# EAGLE schematic AC Breakout (EAGLE 5.11)
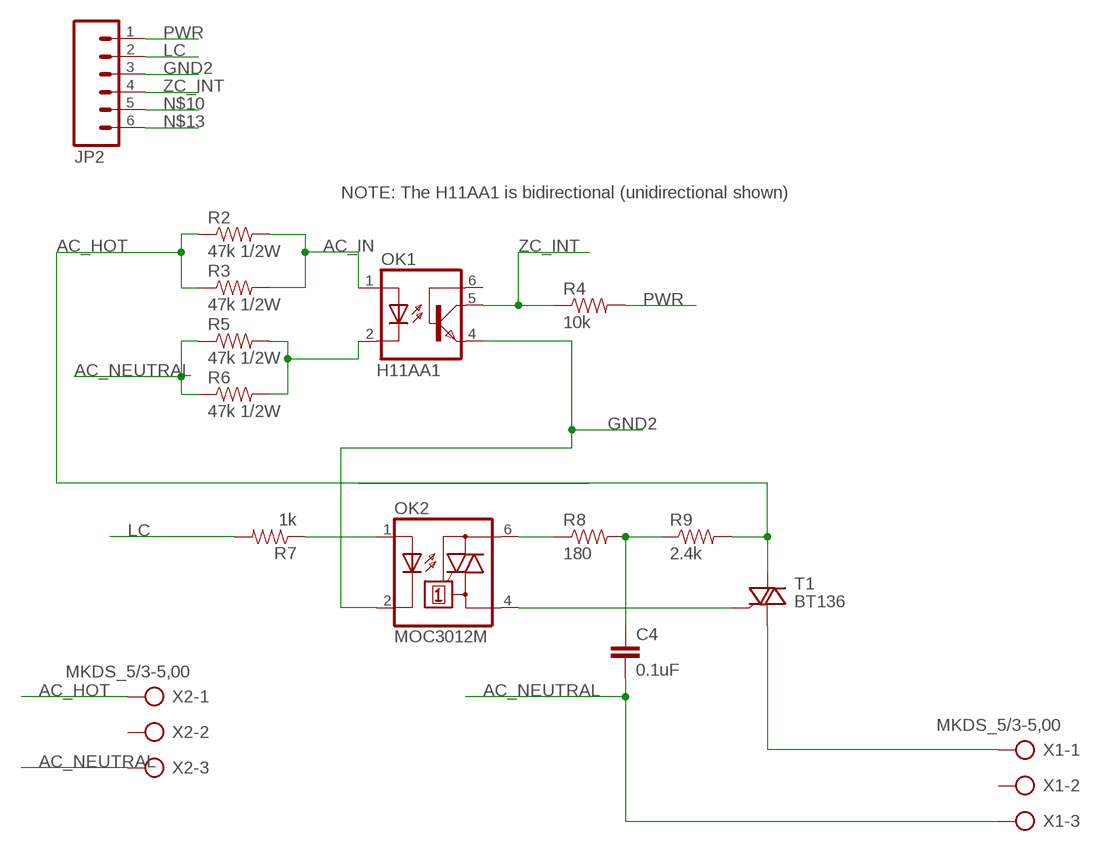
[diagram p0: schematic, sheet 1]

## Parts
C4  0.1uF  CAPPTH2  [CAP-PTH-SMALL2]
JP2  M06SIP  [1X06]
OK1  4N25M  [DIL06]
OK2  MOC3012M  [DIL06]
R2  47k 1/2W  RESISTORPTH-1/2W  [AXIAL-0.5]
R3  47k 1/2W  RESISTORPTH-1/2W  [AXIAL-0.5]
R4  10k  RESISTORPTH-1/4W  [AXIAL-0.4]
R5  47k 1/2W  RESISTORPTH-1/2W  [AXIAL-0.5]
R6  47k 1/2W  RESISTORPTH-1/2W  [AXIAL-0.5]
R7  1k  RESISTORPTH-1/4W  [AXIAL-0.4]
R8  180  RESISTORPTH-1/4W  [AXIAL-0.4]
R9  2.4k  RESISTORPTH-1/4W  [AXIAL-0.4]
T1  BT136  [TO220AB]
X1  MKDS_5/3-5,00  [MKDS_5/3-500]
X2  MKDS_5/3-5,00  [MKDS_5/3-500]

## Nets
AC1 [AC_HOT]: OK2.6(A2) R8.P$1
AC2 [AC_HOT]: C4.1 R8.P$2 R9.P$1
AC_HOT [AC_HOT]: R2.P$1 R3.P$1 R9.P$2 T1.2(A2) X2.1
AC_IN [AC_HOT]: OK1.1(A) R2.P$2 R3.P$2
AC_NEUTRAL [AC_HOT]: C4.2 R5.P$1 R6.P$1 X1.3 X2.3
AC_OUT [AC_HOT]: T1.1(A1) X1.1
GND2: JP2.3 OK1.4(EMI) OK2.2(C)
LC: JP2.2 R7.P$2
N$8: OK2.4(A1) T1.3(G)
N$10: JP2.5
N$13: JP2.6
N$29: OK2.1(A) R7.P$1
NEUT_IN [AC_HOT]: OK1.2(C) R5.P$2 R6.P$2
PWR: JP2.1 R4.P$2
ZC_INT: JP2.4 OK1.5(COL) R4.P$1
Unconnected: OK1.6(BAS) X1.2 X2.2

## Notes on the sheet
- NOTE: The H11AA1 is bidirectional (unidirectional shown)
- H11AA1

## Library data of the parts
C4 = SparkFun:CAP: Capacitor Standard 0603 ceramic capacitor, and 0.1" leaded capacitor.
JP2 = SparkFun:M06: Header 6 Standard 6-pin 0.1" header. Use with straight break away headers (SKU : PRT-00116), right angle break away headers (PRT-00553), swiss pins (PRT-00743), machine pins (PRT-00117), and female headers (PRT-00115). Molex polarized connector foot print use with SKU : PRT-08094 with associated crimp pins and housings. NOTES ON THE VARIANTS LOCK and LOCK_LONGPADS... This footprint was designed to help hold the alignment of a through-hole component (i.e. 6-pin header) while soldering it into place. You may notice that each hole has been shifted either up or down by 0.005 of an inch from it's more standard position (which is a perfectly straight line). This slight alteration caused the pins (the squares in the middle) to touch the edges of the holes. Because they are alternating, it causes a "brace" to hold the component in place. 0.005 has proven to be the perfect amount of "off-center" position when using our standard breakaway headers. Although looks a little odd when you look at the bare footprint, once you have a header in there, the alteration is very hard to notice. Also, if you push a header all the way into place, it is covered up entirely on the bottom side. This idea of altering the position of holes to aid alignment will be further integrated into the Sparkfun Library for other footprints. It can help hold any component with 3 or more connection pins.
OK1 = optocoupler:4N*?M: General Purpose 6-Pin Phototransistor Optocouplers Source: http://www.fairchildsemi.com/ds/4N/4N35-M.pdf; MPN: 4N25-M; OC_FARNELL: 1021349; OC_NEWARK: 98K9084
OK2 = optocoupler:MOC30*M: RANDOM-PHASE OPTOISOLATORS TRIAC DRIVER OUTPUT Source: http://www.fairchildsemi.com MOC3020-M.pdf; MF: FAIRCHILD SEMICONDUCTOR; MPN: MOC3012-M; OC_FARNELL: 1021364; OC_NEWARK: 72K8894
R2-R9 = SparkFun:RESISTOR: Resistor Basic schematic elements and footprints for 0603, 1206, and PTH resistors.
T1 = triac:BT136: Triac BT136 series E sensitive gate Source: http://www.nxp.com/acrobat_download/datasheets/BT136_SERIES_E_2.pdf
X1 X2 = con-phoenix-mkds_5:MKDS_5/3-: MKDS 5/3-6,35 Source: PHOENIX CONTACT

## Net classes
1 AC_HOT: width 0.813 mm, clearance 0.254 mm